# Altium project PV-Simulator.PRJPCB
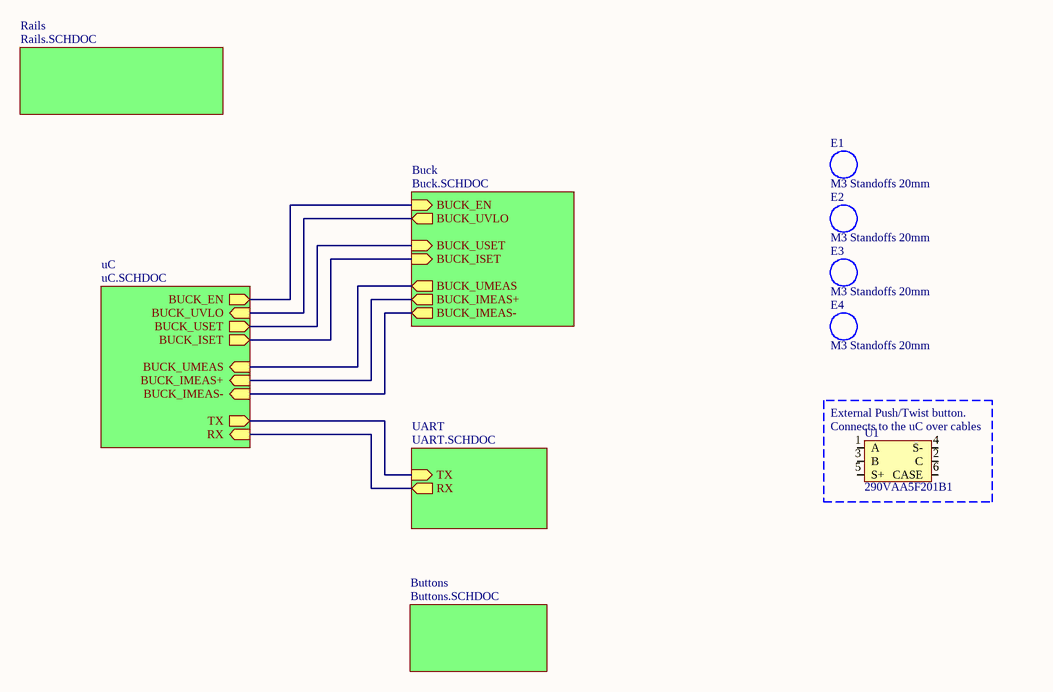
[diagram p0: PV-Simulator.SCHDOC]
5 sheets, 125 parts. Net scope: hierarchical (ports join the sheet entries above them; power ports are global).
Board file: PCB.PCBDOC
Sheets:
  PV-Simulator.SCHDOC
    UART = UART.SCHDOC
    Rails = Rails.SCHDOC
    uC = uC.SCHDOC
    Buck = Buck.SCHDOC

## Sheet PV-Simulator.SCHDOC: PV Simulator
size A4; Author: Alex Murray; DrawnBy: Alex Murray; DocumentNumber: 1; SheetNumber: 1; SheetTotal: 6; CurrentTime: 14:14; CurrentDate: 15-10-29

### Parts
E1  Type: M3 Standoffs 20mm  [THT_STANDOFF_20MM_M3]  (hidden comment: E_STANDOFF_20MM_M3_PLASTIC)
E2  Type: M3 Standoffs 20mm  [THT_STANDOFF_20MM_M3]  (hidden comment: E_STANDOFF_20MM_M3_PLASTIC)
E3  Type: M3 Standoffs 20mm  [THT_STANDOFF_20MM_M3]  (hidden comment: E_STANDOFF_20MM_M3_PLASTIC)
E4  Type: M3 Standoffs 20mm  [THT_STANDOFF_20MM_M3]  (hidden comment: E_STANDOFF_20MM_M3_PLASTIC)
U1  Type: 290VAA5F201B1  [THT_ENCODER_290VAA5F201B1]  (hidden comment: U_ENCODER_2BIT_QUAD_SPST)

### Sub-sheets
Buck = Buck.SCHDOC: BUCK_ISET (in), BUCK_EN (in), BUCK_USET (in), BUCK_UMEAS (out), BUCK_IMEAS+ (out), BUCK_IMEAS- (out), BUCK_UVLO (out)
Buttons = Buttons.SCHDOC (file not in this document): no entries
Rails = Rails.SCHDOC: no entries
UART = UART.SCHDOC: RX (out), TX (in)
uC = uC.SCHDOC: BUCK_USET (out), BUCK_ISET (out), BUCK_EN (out), BUCK_UMEAS (in), BUCK_IMEAS+ (in), BUCK_IMEAS- (in), RX (in), TX (out), BUCK_UVLO (in)

### Nets
BUCK_EN: sheet uC/BUCK_EN, sheet Buck/BUCK_EN
BUCK_IMEAS+: sheet uC/BUCK_IMEAS+, sheet Buck/BUCK_IMEAS+
BUCK_IMEAS-: sheet uC/BUCK_IMEAS-, sheet Buck/BUCK_IMEAS-
BUCK_ISET: sheet uC/BUCK_ISET, sheet Buck/BUCK_ISET
BUCK_UMEAS: sheet uC/BUCK_UMEAS, sheet Buck/BUCK_UMEAS
BUCK_USET: sheet uC/BUCK_USET, sheet Buck/BUCK_USET
BUCK_UVLO: sheet uC/BUCK_UVLO, sheet Buck/BUCK_UVLO
RX: sheet UART/RX, sheet uC/RX
TX: sheet UART/TX, sheet uC/TX

Not connected (* = marked no-connect by the designer): U1 1(A) 2(C) 3(B) 4(S-) 5(S+) 6(CASE)

### Notes on the sheet
- (near U1) External Push/Twist button.
- (near U1) Connects to the uC over cables

### Library data of the parts
E1-E4 = E_STANDOFF_20MM_M3_PLASTIC: HEX STANDOFF M3 NYLON 20MM; Supplier - Digikey: 36-25505-ND
U1 = U_ENCODER_2BIT_QUAD_SPST: 2 Bit Encoder with switch; Supplier - Digikey: CT3010-ND

## Sheet UART.SCHDOC
size A4; DocumentNumber: 2; SheetNumber: 2; SheetTotal: 6
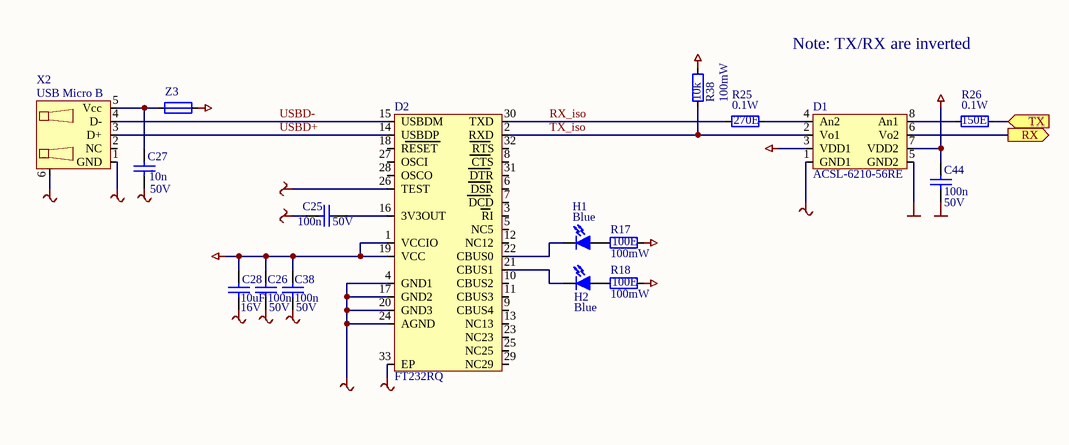
[diagram p1: UART.SCHDOC]

### Parts
C25  value 100n  Value2: 50V  [SMD_0603]  (hidden comment: C_SMD_CER_100N_50V_10%_X7R_0603)
C26  value 100n  Value2: 50V  [SMD_0603]  (hidden comment: C_SMD_CER_100N_50V_10%_X7R_0603)
C27  value 10n  Value2: 50V  [SMD_0603]  (hidden comment: C_SMD_CER_10N_50V_10%_X7R_0603)
C28  value 10uF  Value2: 16V  [SMD_0805]  (hidden comment: C_SMD_CER_10U_16V_10%_X5R_0805)
C38  value 100n  Value2: 50V  [SMD_0603]  (hidden comment: C_SMD_CER_100N_50V_10%_X7R_0603)
C44  value 100n  Value2: 50V  [SMD_0603]  (hidden comment: C_SMD_CER_100N_50V_10%_X7R_0603)
D1  Type: ACSL-6210-56RE  [SMD_SOP_8]  (hidden comment: D_ACSL-6210_SO-8)
D2  Type: FT232RQ  [SMD_QFN-32]  (hidden comment: D_FT232RQ)
H1  Type: Blue  [SMD_0603P]  (hidden comment: H_SMD_LED_BLUE_0603)
H2  Type: Blue  [SMD_0603P]  (hidden comment: H_SMD_LED_BLUE_0603)
R17  value 100E  Value2: 100mW  [SMD_0603]  (hidden comment: R_SMD_THINFILM_100E_0W1_1%_50PPM_0603)
R18  value 100E  Value2: 100mW  [SMD_0603]  (hidden comment: R_SMD_THINFILM_100E_0W1_1%_50PPM_0603)
R25  value 270E  Value2: 0.1W  [SMD_0603]  (hidden comment: R_SMD_THINFILM_270E_0W1_1%_50PPM_0603)
R26  value 150E  Value2: 0.1W  [SMD_0603]  (hidden comment: R_SMD_THINFILM_150E_0W1_1%_50PPM_0603)
R38  value 10k  Value2: 100mW  [SMD_0603]  (hidden comment: R_SMD_THINFILM_10K_0W1_1%_50PPM_0603)
X2  Type: USB Micro B  [SMD_USB_MICRO_B_2.0]  (hidden comment: X_SMD_USB_MICRO-B_2.0)
Z3  Z_SMD_FERRITE_1A5_470E@100MHZ_0603  [SMD_0603]  (value not drawn)

### Ports
RX (out), TX (in)

### Nets
+3.3V: C44.2 D1.7(VDD2)
+5Vi: C26.2 C28.2 C38.2 D1.3(VDD1) D2.1(VCCIO) D2.19(VCC) R17.2 R18.2 R38.2 Z3.2
GND: C44.1 D1.5(GND2)
GNDi: C25.1 C26.1 C27.1 C28.1 C38.1 D1.1(GND1) D2.4(GND1) D2.17(GND2) D2.20(GND3) D2.24(AGND) D2.26(TEST) D2.33(EP) X2.1(GND) X2.6(Shield)
RX: D1.6(Vo2) ; port RX
RX_iso: D2.30(TXD) R25.1
TX: R26.2 ; port TX
TX_iso: D1.2(Vo1) D2.2(RXD) R38.1
USBD+: D2.14(USBDP) X2.3(D+)
USBD-: D2.15(USBDM) X2.4(D-)
NetC25_2: C25.2 D2.16(3V3OUT)
NetC27_2: C27.2 X2.5(Vcc) Z3.1
NetD1_4: D1.4(An2) R25.2
NetD1_8: D1.8(An1) R26.1
NetD2_21: D2.21(CBUS1) H2.2
NetD2_22: D2.22(CBUS0) H1.2
NetH1_1: H1.1 R17.1
NetH2_1: H2.1 R18.1

Not connected (* = marked no-connect by the designer): D2 3(RI) 5(NC5) 6(DSR) 7(DCD) 8(CTS) 9(CBUS4) 10(CBUS2) 11(CBUS3) 12(NC12) 13(NC13) 18(RESET) 23(NC23) 25(NC25) 27(OSCI) 28(OSCO) 29(NC29) 31(DTR) 32(RTS); X2 2(NC)

### Notes on the sheet
- Note: TX/RX are inverted

### Library data of the parts
C25 C26 C38 C44 = C_SMD_CER_100N_50V_10%_X7R_0603: SMD Capacitor; Supplier - E+H-flowtec SAP: 50092748; Supplier - Digikey: 1276-1936-1-ND
C27 = C_SMD_CER_10N_50V_10%_X7R_0603: SMD Capacitor; Supplier - E+H-flowtec SAP: 50092743; Supplier - Digikey: 399-1091-1-ND
C28 = C_SMD_CER_10U_16V_10%_X5R_0805: SMD Capacitor; Supplier - E+H-flowtec SAP: 71107344; Supplier - Digikey: 490-6473-1-ND
D1 = D_ACSL-6210_SO-8: Multi-Channel and Bi-Directional 15MBd Digital Logic Gate Optocoupler; Supplier - Digikey: 516-2916-1-ND
D2 = D_FT232RQ: FT232r USB UART IC; Supplier - Digikey: 768-1008-1-ND
H1 H2 = H_SMD_LED_BLUE_0603: Blue LED, 5mA; Supplier - Digikey: VAOL-S6SB4CT-ND
R17 R18 = R_SMD_THINFILM_100E_0W1_1%_50PPM_0603: SMD Resistor; Supplier - E+H-flowtec SAP: 50092674; Supplier - Digikey: YAG2128CT-ND
R25 = R_SMD_THINFILM_270E_0W1_1%_50PPM_0603: SMD Resistor; Supplier - E+H-flowtec SAP: 50098310; Supplier - Digikey: P270DBCT-ND
R26 = R_SMD_THINFILM_150E_0W1_1%_50PPM_0603: SMD Resistor; Supplier - E+H-flowtec SAP: 50092676; Supplier - Digikey: P150DBCT-ND
R38 = R_SMD_THINFILM_10K_0W1_1%_50PPM_0603: SMD Resistor; Supplier - E+H-flowtec SAP: 50092700; Supplier - Digikey: YAG2321CT-ND
Z3 = Z_SMD_FERRITE_1A5_470E@100MHZ_0603: FERRITE CHIP 470 OHM 1500MA 0603; Value: 1.5A; Supplier - Digikey: 490-5257-1-ND; Type: BLM18KG471SN1D
X2 = X_SMD_USB_MICRO-B_2.0: Supplier - Digikey: 609-4618-1-ND

## Sheet Rails.SCHDOC
size A4; DocumentNumber: 5; SheetNumber: 5; SheetTotal: 6
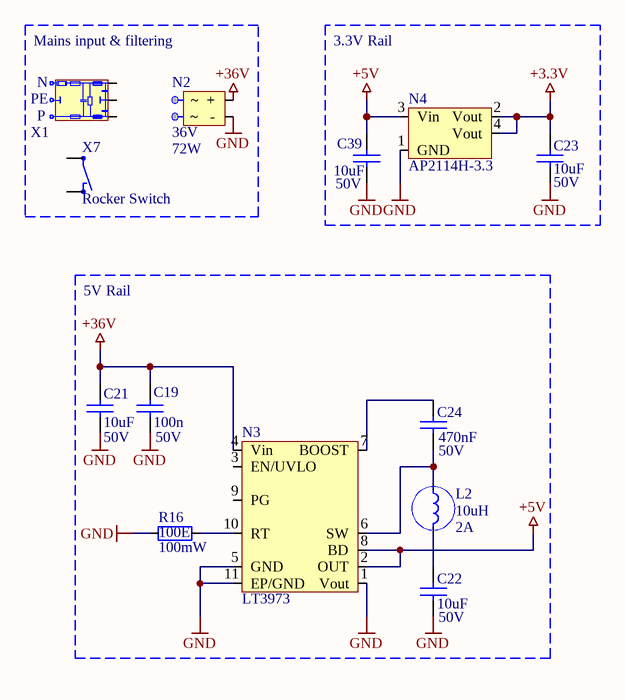
[diagram p2: Rails.SCHDOC]

### Parts
C19  value 100n  Value2: 50V  [SMD_0603]  (hidden comment: C_SMD_CER_100N_50V_10%_X7R_0603)
C21  value 10uF  Value2: 50V  [SMD_1210]  (hidden comment: C_SMD_CER_10U_50V_10%_X7R_1210)
C22  value 10uF  Value2: 50V  [SMD_1210]  (hidden comment: C_SMD_CER_10U_50V_10%_X7R_1210)
C23  value 10uF  Value2: 50V  [SMD_1210]  (hidden comment: C_SMD_CER_10U_50V_10%_X7R_1210)
C24  value 470nF  Value2: 50V  [SMD_0603]  (hidden comment: C_SMD_CER_470N_50V_10%_X7R_0603)
C39  value 10uF  Value2: 50V  [SMD_1210]  (hidden comment: C_SMD_CER_10U_50V_10%_X7R_1210)
L2  value 10uH  Value2: 2A  [SMD_INDUCT_74477710]  (hidden comment: L_SMD_10U_2A_20%_IND_74477710)
N2  value 36V  Value2: 72W  [THT_CON_P2.54_D0.9_1X2]  (hidden comment: N_EXT_ACDC_36V_75W)
N3  Type: LT3973  [SMD_DFN_10_3X3]  (hidden comment: N_LT3973-5_DFN-10)
N4  Type: AP2114H-3.3  [SMD_SOT_22_3]  (hidden comment: N_AP2114H-3.3_SOT223)
R16  value 100E  Value2: 100mW  [SMD_0603]  (hidden comment: R_SMD_THINFILM_100E_0W1_1%_50PPM_0603)
X1  X_POWER_ENTRY_MODULE_W/FILTER_W/FUSE_10A_SMD_CONNECTOR  [SMD_CON_P5.08_W2.0_L5.0_1X3]  (value not drawn)
X7  Type: Rocker Switch  [THT_CON_P5.08_D1.5_1X2]  (hidden comment: X_SWITCH_ROCKER_SPST_6A_250VAC)

### Blocks framed on the sheet
Mains input & filtering: N2 X1 X7
3.3V Rail: C23 C39 N4
5V Rail: C19 C21 C22 C24 L2 N3 R16

### Nets
+3.3V: C23.2 N4.2(Vout) N4.4(Vout)
+5V: C39.2 N3.2(OUT) N3.8(BD) N4.3(Vin)
+36V: C19.2 C21.2 N2.1(~__+) N3.4(Vin)
GND: C19.1 C21.1 C22.1 C23.1 C39.1 N2.2(~___-) N3.1(Vout) N3.5(GND) N3.11(EP/GND) N4.1(GND) R16.1
NetC22_2: C22.2 L2.2
NetC24_1: C24.1 L2.1 N3.6(SW)
NetC24_2: C24.2 N3.7(BOOST)
NetN3_10: N3.10(RT) R16.2

Not connected (* = marked no-connect by the designer): N3 3(EN/UVLO) 9(PG); X1 1 2 3; X7 1 2

### Notes on the sheet
- (in symbol X_POWER_ENTRY_MODULE_W/FILTER_W/FUSE_10A_SMD_CONNECTOR) N; PE; P

### Library data of the parts
C19 = C_SMD_CER_100N_50V_10%_X7R_0603: SMD Capacitor; Supplier - E+H-flowtec SAP: 50092748; Supplier - Digikey: 1276-1936-1-ND
C21-C23 C39 = C_SMD_CER_10U_50V_10%_X7R_1210: SMD Ceramic capacitor; Supplier - Digikey: 490-6544-1-ND
L2 = L_SMD_10U_2A_20%_IND_74477710: SMD Inductor; Supplier - Digikey: 732-1200-1-ND; Type: 74477710
N3 = N_LT3973-5_DFN-10-3x3: 42V, 750mA Step-Down Regulator with 2.5uA Quiescent Current and Integrated Diodes; Supplier - Digikey: LT3973EDD-5#PBF-ND
N4 = N_AP2114H-3.3_SOT223: 1A Low Noise CMOS LDO Regulator; Supplier - Digikey: AP2114H-3.3TRG1DICT-ND
R16 = R_SMD_THINFILM_100E_0W1_1%_50PPM_0603: SMD Resistor; Supplier - E+H-flowtec SAP: 50092674; Supplier - Digikey: YAG2128CT-ND
X1 = X_POWER_ENTRY_MODULE_W/FILTER_W/FUSE_10A_SMD_CONNECTOR: MOD POWER ENTRY INLET WITH FUSE 10A; Supplier - Digikey: 817-1489-ND
C24 = C_SMD_CER_470N_50V_10%_X7R_0603: Supplier - Digikey: 587-3170-1-ND
N2 = N_EXT_ACDC_36V_75W: Supplier - Digikey: 285-1829-ND
X7 = X_SWITCH_ROCKER_SPST_6A_250VAC: Supplier - Digikey: 360-1721-ND

## Sheet uC.SCHDOC
size A4; DocumentNumber: 4; SheetNumber: 4; SheetTotal: 6
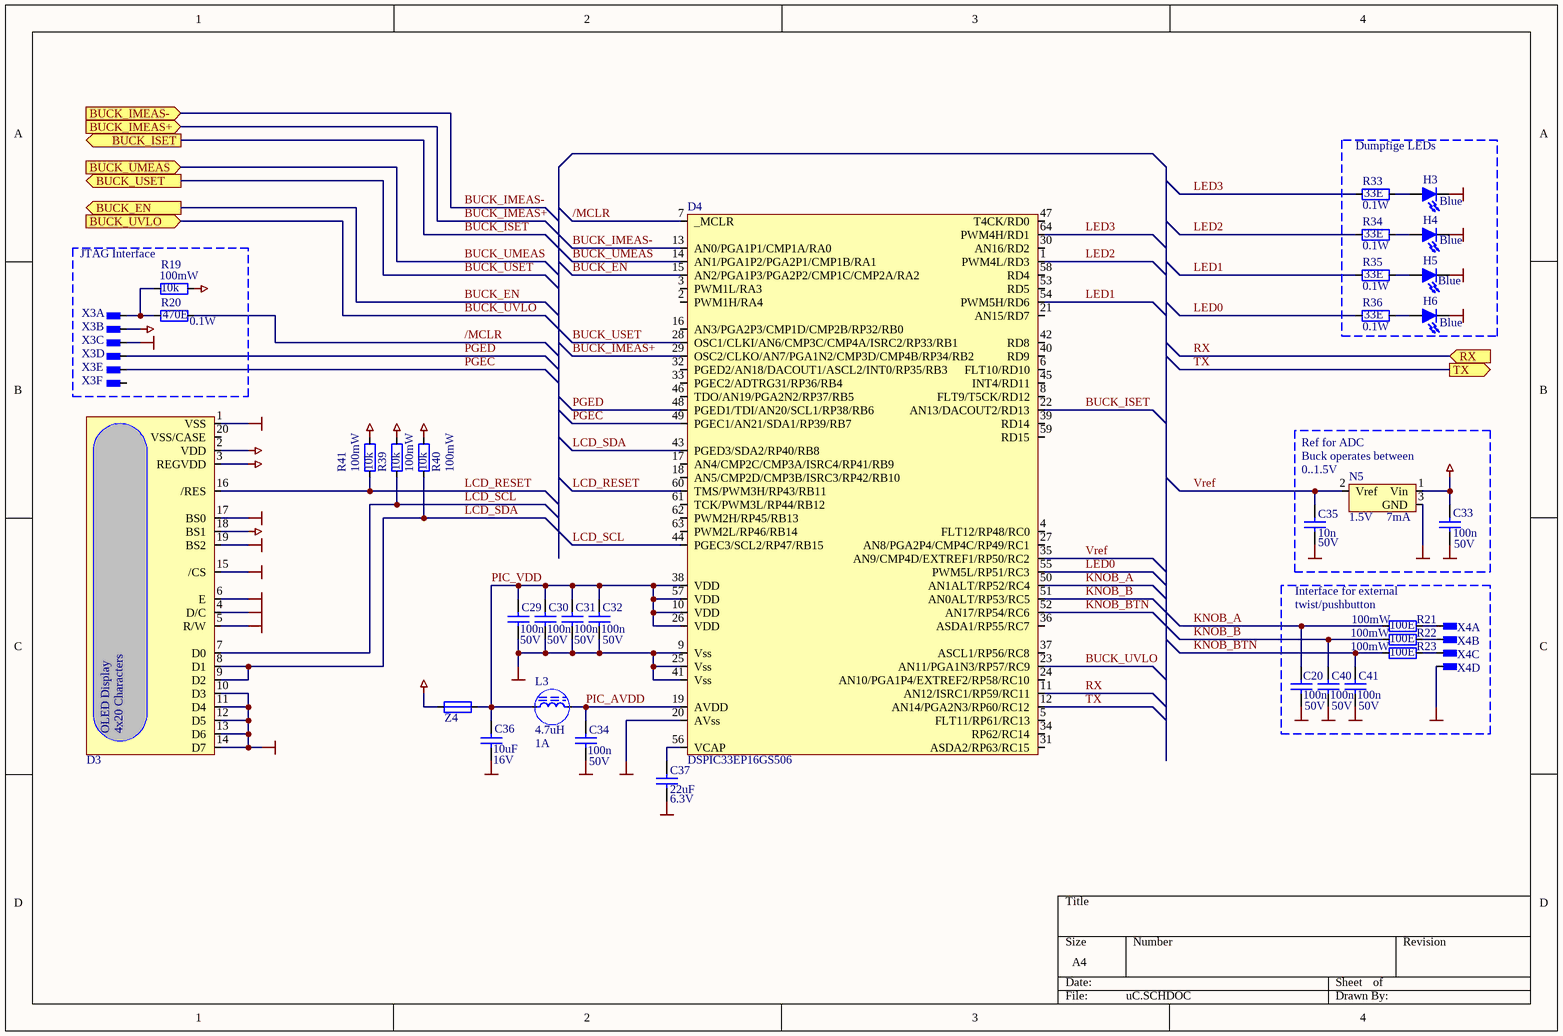
[diagram p3: uC.SCHDOC]

### Parts
C20  value 100n  Value2: 50V  [SMD_0603]  (hidden comment: C_SMD_CER_100N_50V_10%_X7R_0603)
C29  value 100n  Value2: 50V  [SMD_0603]  (hidden comment: C_SMD_CER_100N_50V_10%_X7R_0603)
C30  value 100n  Value2: 50V  [SMD_0603]  (hidden comment: C_SMD_CER_100N_50V_10%_X7R_0603)
C31  value 100n  Value2: 50V  [SMD_0603]  (hidden comment: C_SMD_CER_100N_50V_10%_X7R_0603)
C32  value 100n  Value2: 50V  [SMD_0603]  (hidden comment: C_SMD_CER_100N_50V_10%_X7R_0603)
C33  value 100n  Value2: 50V  [SMD_0603]  (hidden comment: C_SMD_CER_100N_50V_10%_X7R_0603)
C34  value 100n  Value2: 50V  [SMD_0603]  (hidden comment: C_SMD_CER_100N_50V_10%_X7R_0603)
C35  value 10n  Value2: 50V  [SMD_0603]  (hidden comment: C_SMD_CER_10N_50V_10%_X7R_0603)
C36  value 10uF  Value2: 16V  [SMD_0805]  (hidden comment: C_SMD_CER_10U_16V_10%_X5R_0805)
C37  value 22uF  Value2: 6.3V  [SMD_1206]  (hidden comment: C_SMD_CER_22U_6V3_20%_X5R_1206)
C40  value 100n  Value2: 50V  [SMD_0603]  (hidden comment: C_SMD_CER_100N_50V_10%_X7R_0603)
C41  value 100n  Value2: 50V  [SMD_0603]  (hidden comment: C_SMD_CER_100N_50V_10%_X7R_0603)
D3  D_LCD_80CHAR_20X4_NHD-0420CW-AR3  [THT_CON_P2.54_D0.9_2X10]  (value not drawn)
D4  Type: DSPIC33EP16GS506  [SMD_TQFP-64]  (hidden comment: D_DSPIC33EP16GS506_TQFP-64)
H3  Type: Blue  [SMD_0603P]  (hidden comment: H_SMD_LED_BLUE_0603)
H4  Type: Blue  [SMD_0603P]  (hidden comment: H_SMD_LED_BLUE_0603)
H5  Type: Blue  [SMD_0603P]  (hidden comment: H_SMD_LED_BLUE_0603)
H6  Type: Blue  [SMD_0603P]  (hidden comment: H_SMD_LED_BLUE_0603)
L3  value 4.7uH  Value2: 1A  [SMD_0806]  (hidden comment: L_SMD_4U7_1A_20%_0806)
N5  value 1.5V  Value2: 7mA  [SMD_SOT_23_3]  (hidden comment: N_UREF_1V5_0A007_52UVRMS_ISL21080CIH315Z_SOT-23-3)
R19  value 10k  Value2: 100mW  [SMD_0603]  (hidden comment: R_SMD_THINFILM_10K_0W1_1%_50PPM_0603)
R20  value 470E  Value2: 0.1W  [SMD_0603]  (hidden comment: R_SMD_THINFILM_470E_0W1_1%_50PPM_0603)
R21  value 100E  Value2: 100mW  [SMD_0603]  (hidden comment: R_SMD_THINFILM_100E_0W1_1%_50PPM_0603)
R22  value 100E  Value2: 100mW  [SMD_0603]  (hidden comment: R_SMD_THINFILM_100E_0W1_1%_50PPM_0603)
R23  value 100E  Value2: 100mW  [SMD_0603]  (hidden comment: R_SMD_THINFILM_100E_0W1_1%_50PPM_0603)
R33  value 33E  Value2: 0.1W  [SMD_0603]  (hidden comment: R_SMD_THINFILM_33E_0W1_1%_50PPM_0603)
R34  value 33E  Value2: 0.1W  [SMD_0603]  (hidden comment: R_SMD_THINFILM_33E_0W1_1%_50PPM_0603)
R35  value 33E  Value2: 0.1W  [SMD_0603]  (hidden comment: R_SMD_THINFILM_33E_0W1_1%_50PPM_0603)
R36  value 33E  Value2: 0.1W  [SMD_0603]  (hidden comment: R_SMD_THINFILM_33E_0W1_1%_50PPM_0603)
R39  value 10k  Value2: 100mW  [SMD_0603]  (hidden comment: R_SMD_THINFILM_10K_0W1_1%_50PPM_0603)
R40  value 10k  Value2: 100mW  [SMD_0603]  (hidden comment: R_SMD_THINFILM_10K_0W1_1%_50PPM_0603)
R41  value 10k  Value2: 100mW  [SMD_0603]  (hidden comment: R_SMD_THINFILM_10K_0W1_1%_50PPM_0603)
X3  X_CONNECTOR_P2.54_D0.9_1X6  [THT_CON_P2.54_D0.9_1X6]  (value not drawn)  (parts A,B,C,D,E,F of 6)
X4  X_CONNECTOR_P2.54_D0.9_1X4  [THT_CON_P2.54_D0.9_1X4]  (value not drawn)  (parts A,B,C,D of 4)
Z4  Z_SMD_FERRITE_1A5_470E@100MHZ_0603  [SMD_0603]  (value not drawn)

### Blocks framed on the sheet
Dumpfige LEDs: H3-H6 R33-R36
JTAG Interface: R19 R20 X3

### Ports
BUCK_EN (out), BUCK_IMEAS+ (in), BUCK_IMEAS- (in), BUCK_ISET (out), BUCK_UMEAS (in), BUCK_USET (out), BUCK_UVLO (in), RX (in), TX (out)

### Nets
+3.3V: C33.2 N5.1(Vin) R19.2 X3.2 Z4.2
+5V: D3.2(VDD) D3.3(REGVDD) D3.18(BS1) R39.2 R40.2 R41.2
GND: C20.1 C29.1 C30.1 C31.1 C32.1 C33.1 C34.1 C35.1 C36.1 C37.1 C40.1 C41.1 D3.1(VSS) D3.4(D/C) D3.5(R/W) D3.6(E) D3.10(D3) D3.11(D4) D3.12(D5) D3.13(D6) D3.14(D7) D3.15(/CS) D3.17(BS0) D3.19(BS2) D4.9(Vss) D4.20(AVss) D4.25(Vss) D4.41(Vss) H3.2 H4.2 H5.2 H6.2 N5.3(GND) X3.3 X4.4
/MCLR: D4.7(_MCLR) R20.2
BUCK_EN: D4.15(AN2/PGA1P3/PGA2P2/CMP1C/CMP2A/RA2) ; port BUCK_EN
BUCK_IMEAS+: D4.29(OSC2/CLKO/AN7/PGA1N2/CMP3D/CMP4B/RP34/RB2) ; port BUCK_IMEAS+
BUCK_IMEAS-: D4.13(AN0/PGA1P1/CMP1A/RA0) ; port BUCK_IMEAS-
BUCK_ISET: D4.22(AN13/DACOUT2/RD13) ; port BUCK_ISET
BUCK_UMEAS: D4.14(AN1/PGA1P2/PGA2P1/CMP1B/RA1) ; port BUCK_UMEAS
BUCK_USET: D4.28(OSC1/CLKI/AN6/CMP3C/CMP4A/ISRC2/RP33/RB1) ; port BUCK_USET
BUCK_UVLO: D4.23(AN11/PGA1N3/RP57/RC9) ; port BUCK_UVLO
KNOB_A: C20.2 D4.50(AN1ALT/RP52/RC4) R21.1
KNOB_B: C40.2 D4.51(AN0ALT/RP53/RC5) R22.1
KNOB_BTN: C41.2 D4.52(AN17/RP54/RC6) R23.1
LCD_RESET: D3.16(/RES) D4.60(TMS/PWM3H/RP43/RB11) R41.1
LCD_SCL: D3.7(D0) D4.44(PGEC3/SCL2/RP47/RB15) R39.1
LCD_SDA: D3.8(D1) D3.9(D2) D4.43(PGED3/SDA2/RP40/RB8) R40.1
LED0: D4.55(PWM5L/RP51/RC3) R36.1
LED1: D4.54(PWM5H/RD6) R35.1
LED2: D4.1(PWM4L/RD3) R34.1
LED3: D4.64(PWM4H/RD1) R33.1
PGEC: D4.49(PGEC1/AN21/SDA1/RP39/RB7) X3.5
PGED: D4.48(PGED1/TDI/AN20/SCL1/RP38/RB6) X3.4
PIC_AVDD: C34.2 D4.19(AVDD) L3.2
PIC_VDD: C29.2 C30.2 C31.2 C32.2 C36.2 D4.10(VDD) D4.26(VDD) D4.38(VDD) D4.57(VDD) L3.1 Z4.1
RX: D4.11(AN12/ISRC1/RP59/RC11) ; port RX
TX: D4.12(AN14/PGA2N3/RP60/RC12) ; port TX
Vref: C35.2 D4.35(AN9/CMP4D/EXTREF1/RP50/RC2) N5.2(Vref)
NetC37_2: C37.2 D4.56(VCAP)
NetH3_1: H3.1 R33.2
NetH4_1: H4.1 R34.2
NetH5_1: H5.1 R35.2
NetH6_1: H6.1 R36.2
NetR19_1: R19.1 R20.1 X3.1
NetR21_2: R21.2 X4.1
NetR22_2: R22.2 X4.2
NetR23_2: R23.2 X4.3

Not connected (* = marked no-connect by the designer): D3 20(VSS/CASE); D4 2(PWM1H/RA4) 3(PWM1L/RA3) 4(FLT12/RP48/RC0) 5(FLT11/RP61/RC13) 6(FLT10/RD10) 8(FLT9/T5CK/RD12) 16(AN3/PGA2P3/CMP1D/CMP2B/RP32/RB0) 17(AN4/CMP2C/CMP3A/ISRC4/RP41/RB9) 18(AN5/CMP2D/CMP3B/ISRC3/RP42/RB10) 21(AN15/RD7) 24(AN10/PGA1P4/EXTREF2/RP58/RC10) 27(AN8/PGA2P4/CMP4C/RP49/RC1) 30(AN16/RD2) 31(ASDA2/RP63/RC15) 32(PGED2/AN18/DACOUT1/ASCL2/INT0/RP35/RB3) 33(PGEC2/ADTRG31/RP36/RB4) 34(RP62/RC14) 36(ASDA1/RP55/RC7) 37(ASCL1/RP56/RC8) 39(RD14) 40(RD9) 42(RD8) 45(INT4/RD11) 46(TDO/AN19/PGA2N2/RP37/RB5) 47(T4CK/RD0) 53(RD5) 58(RD4) 59(RD15) 61(TCK/PWM3L/RP44/RB12) 62(PWM2H/RP45/RB13) 63(PWM2L/RP46/RB14); X3 6

### Notes on the sheet
- (near N5) Ref for ADC
- (near N5) Buck operates between
- (near N5) 0..1.5V
- Interface for external
- (near R21) twist/pushbutton
- (in symbol D_LCD_80CHAR_20X4_NHD-0420CW-AR3) OLED Display; 4x20 Characters

### Library data of the parts
C20 C29-C34 C40 C41 = C_SMD_CER_100N_50V_10%_X7R_0603: SMD Capacitor; Supplier - E+H-flowtec SAP: 50092748; Supplier - Digikey: 1276-1936-1-ND
C35 = C_SMD_CER_10N_50V_10%_X7R_0603: SMD Capacitor; Supplier - E+H-flowtec SAP: 50092743; Supplier - Digikey: 399-1091-1-ND
C36 = C_SMD_CER_10U_16V_10%_X5R_0805: SMD Capacitor; Supplier - E+H-flowtec SAP: 71107344; Supplier - Digikey: 490-6473-1-ND
C37 = C_SMD_CER_22U_6V3_20%_X5R_1206: SMD Capacitor; Supplier - E+H-flowtec SAP: 71128390; Supplier - Digikey: 587-3398-1-ND
H3-H6 = H_SMD_LED_BLUE_0603: Blue LED, 5mA; Supplier - Digikey: VAOL-S6SB4CT-ND
L3 = L_SMD_4U7_1A_20%_0806: SMD Inductor; Supplier - Digikey: 732-2956-1-ND
R19 R39-R41 = R_SMD_THINFILM_10K_0W1_1%_50PPM_0603: SMD Resistor; Supplier - E+H-flowtec SAP: 50092700; Supplier - Digikey: YAG2321CT-ND
R20 = R_SMD_THINFILM_470E_0W1_1%_50PPM_0603: SMD Resistor; Supplier - E+H-flowtec SAP: 50092681
R21-R23 = R_SMD_THINFILM_100E_0W1_1%_50PPM_0603: SMD Resistor; Supplier - E+H-flowtec SAP: 50092674; Supplier - Digikey: YAG2128CT-ND
R33-R36 = R_SMD_THINFILM_33E_0W1_1%_50PPM_0603: SMD Resistor; Supplier - E+H-flowtec SAP: 50092668; Supplier - Digikey: MCT0603-33.0-CFCT-ND
X3 = X_CONNECTOR_P2.54_D0.9_1X6: Pitch 2.54, Diameter 0.9mm, 1 row, 6 columns; Type: Pitch 2.54, Diameter 0.9mm, 1 row, 3 columns
X4 = X_CONNECTOR_P2.54_D0.9_1X4: Pitch 2.54, Diameter 0.9mm, 1 row, 4 columns; Type: Pitch 2.54, Diameter 0.9mm, 1 row, 3 columns
Z4 = Z_SMD_FERRITE_1A5_470E@100MHZ_0603: as Z3 on sheet UART; Supplier - Digikey: 490-5257-1-ND; Type: BLM18KG471SN1D
D3 = D_LCD_80CHAR_20X4_NHD-0420CW-AR3: Supplier - Digikey: NHD-0420CW-AR3-ND
D4 = D_DSPIC33EP16GS506_TQFP-64: Supplier - Digikey: DSPIC33EP16GS506-I/PT-ND
N5 = N_UREF_1V5_0A007_52UVRMS_ISL21080CIH315Z_SOT-23-3: Supplier - Digikey: ISL21080CIH315Z-TKCT-ND; Type: ISL21080CIH315Z-TK

## Sheet Buck.SCHDOC
size A4; DocumentNumber: 3; SheetNumber: 3; SheetTotal: 6
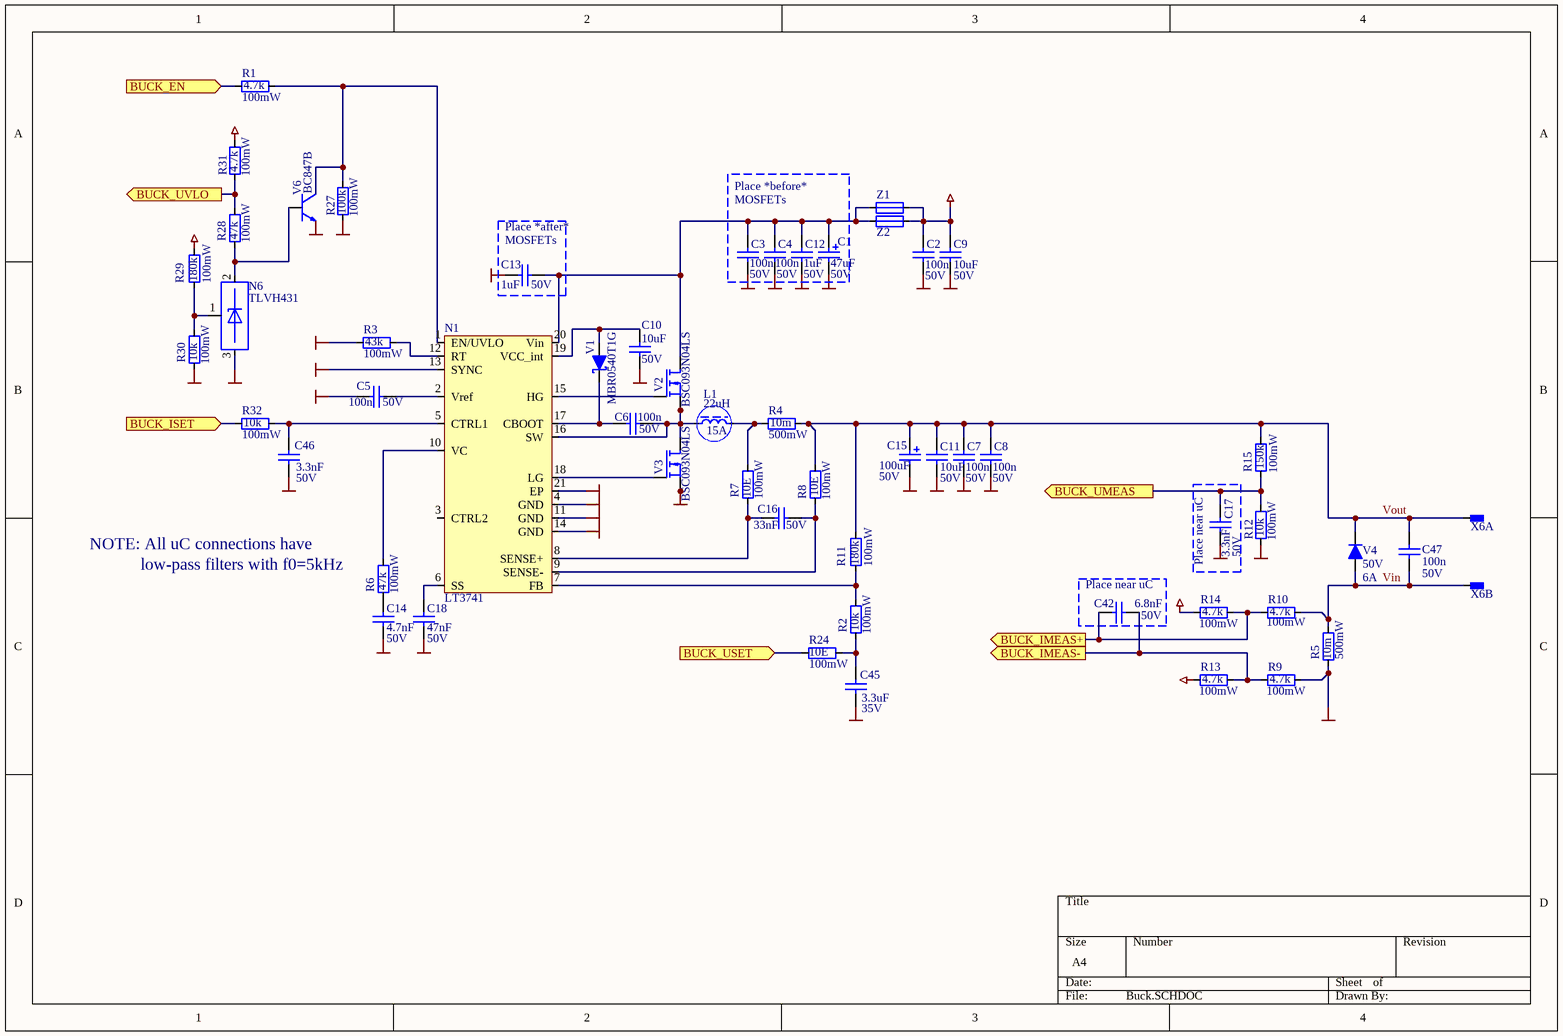
[diagram p4: Buck.SCHDOC]

### Parts
C1  value 47uF  Value2: 50V  [SMD_CAP_CV_8x10L]  (hidden comment: C_SMD_ALU_47U_50V_20%_PCV1H470MCL7GS)
C2  value 100n  Value2: 50V  [SMD_0603]  (hidden comment: C_SMD_CER_100N_50V_10%_X7R_0603)
C3  value 100n  Value2: 50V  [SMD_0603]  (hidden comment: C_SMD_CER_100N_50V_10%_X7R_0603)
C4  value 100n  Value2: 50V  [SMD_0603]  (hidden comment: C_SMD_CER_100N_50V_10%_X7R_0603)
C5  value 100n  Value2: 50V  [SMD_0603]  (hidden comment: C_SMD_CER_100N_50V_10%_X7R_0603)
C6  value 100n  Value2: 50V  [SMD_0603]  (hidden comment: C_SMD_CER_100N_50V_10%_X7R_0603)
C7  value 100n  Value2: 50V  [SMD_0603]  (hidden comment: C_SMD_CER_100N_50V_10%_X7R_0603)
C8  value 100n  Value2: 50V  [SMD_0603]  (hidden comment: C_SMD_CER_100N_50V_10%_X7R_0603)
C9  value 10uF  Value2: 50V  [SMD_1210]  (hidden comment: C_SMD_CER_10U_50V_10%_X7R_1210)
C10  value 10uF  Value2: 50V  [SMD_1210]  (hidden comment: C_SMD_CER_10U_50V_10%_X7R_1210)
C11  value 10uF  Value2: 50V  [SMD_1210]  (hidden comment: C_SMD_CER_10U_50V_10%_X7R_1210)
C12  value 1uF  Value2: 50V  [SMD_0805]  (hidden comment: C_SMD_CER_1U_50V_10%_X7R_0805)
C13  value 1uF  Value2: 50V  [SMD_0805]  (hidden comment: C_SMD_CER_1U_50V_10%_X7R_0805)
C14  value 4.7nF  Value2: 50V  [SMD_0603]  (hidden comment: C_SMD_CER_4N7_50V_10%_X7R_0603)
C15  value 100uF  Value2: 50V  [SMD_CAP_CV_10x12.7L]  (hidden comment: C_SMD_ALU_100U_50V_20%_PCV1H101MCL2GS)
C16  value 33nF  Value2: 50V  [SMD_0603]  (hidden comment: C_SMD_CER_33N_50V_10%_X7R_0603)
C17  value 3.3nF  Value2: 50V  [SMD_0603]  (hidden comment: C_SMD_CER_3N3_50V_10%_X7R_0603)
C18  value 47nF  Value2: 50V  [SMD_0603]  (hidden comment: C_SMD_CER_47N_50V_10%_X7R_0603)
C42  value 6.8nF  Value2: 50V  [SMD_0603]  (hidden comment: C_SMD_CER_6N8_50V_10%_X7R_0603)
C45  value 3.3uF  Value2: 35V  [SMD_0805]  (hidden comment: C_SMD_CER_3U3_35V_10%_X7R_0805)
C46  value 3.3nF  Value2: 50V  [SMD_0603]  (hidden comment: C_SMD_CER_3N3_50V_10%_X7R_0603)
C47  value 100n  Value2: 50V  [SMD_0603]  (hidden comment: C_SMD_CER_100N_50V_10%_X7R_0603)
L1  value 22uH  Value2: 15A  [SMD_INDUCT-74435582200]  (hidden comment: L_SMD_22U_15A_7MOHM_20%_74435582200)
N1  Type: LT3741  [SMD_QFN-20]  (hidden comment: N_LT3741EUF_QFN-20)
N6  Type: TLVH431  [SMD_SOT_23_3]  (hidden comment: N_TLVH431_SOT23-3)
R1  value 4.7k  Value2: 100mW  [SMD_0603]  (hidden comment: R_SMD_THINFILM_4K7_0W1_1%_50PPM_0603)
R2  value 10k  Value2: 100mW  [SMD_0603]  (hidden comment: R_SMD_THINFILM_10K_0W1_1%_50PPM_0603)
R3  value 43k  Value2: 100mW  [SMD_0603]  (hidden comment: R_SMD_THINFILM_43K_0W1_0.1%_25PPM_0603)
R4  value 10m  Value2: 500mW  [SMD_1206]  (hidden comment: R_SMD_THICKFILM_0E01_0W5_0.5%_50PPM_1206)
R5  value 10m  Value2: 500mW  [SMD_1206]  (hidden comment: R_SMD_THICKFILM_0E01_0W5_0.5%_50PPM_1206)
R6  value 47k  Value2: 100mW  [SMD_0603]  (hidden comment: R_SMD_THINFILM_47K_0W1_1%_50PPM_0603)
R7  value 10E  Value2: 100mW  [SMD_0603]  (hidden comment: R_SMD_THINFILM_10E_0W1_1%_50PPM_0603)
R8  value 10E  Value2: 100mW  [SMD_0603]  (hidden comment: R_SMD_THINFILM_10E_0W1_1%_50PPM_0603)
R9  value 4.7k  Value2: 100mW  [SMD_0603]  (hidden comment: R_SMD_THINFILM_4K7_0W1_1%_50PPM_0603)
R10  value 4.7k  Value2: 100mW  [SMD_0603]  (hidden comment: R_SMD_THINFILM_4K7_0W1_1%_50PPM_0603)
R11  value 180k  Value2: 100mW  [SMD_0603]  (hidden comment: R_SMD_THINFILM_180K_0W1_0.1%_25PPM_0603)
R12  value 10k  Value2: 100mW  [SMD_0603]  (hidden comment: R_SMD_THINFILM_10K_0W1_1%_50PPM_0603)
R13  value 4.7k  Value2: 100mW  [SMD_0603]  (hidden comment: R_SMD_THINFILM_4K7_0W1_1%_50PPM_0603)
R14  value 4.7k  Value2: 100mW  [SMD_0603]  (hidden comment: R_SMD_THINFILM_4K7_0W1_1%_50PPM_0603)
R15  value 150k  Value2: 100mW  [SMD_0603]  (hidden comment: R_SMD_THINFILM_150K_0W1_1%_50PPM_0603)
R24  value 10E  Value2: 100mW  [SMD_0603]  (hidden comment: R_SMD_THINFILM_10E_0W1_1%_50PPM_0603)
R27  value 100k  Value2: 100mW  [SMD_0603]  (hidden comment: R_SMD_THINFILM_100K_0W1_1%_50PPM_0603)
R28  value 47k  Value2: 100mW  [SMD_0603]  (hidden comment: R_SMD_THINFILM_47K_0W1_1%_50PPM_0603)
R29  value 180k  Value2: 100mW  [SMD_0603]  (hidden comment: R_SMD_THINFILM_180K_0W1_0.1%_25PPM_0603)
R30  value 10k  Value2: 100mW  [SMD_0603]  (hidden comment: R_SMD_THINFILM_10K_0W1_1%_50PPM_0603)
R31  value 4.7k  Value2: 100mW  [SMD_0603]  (hidden comment: R_SMD_THINFILM_4K7_0W1_1%_50PPM_0603)
R32  value 10k  Value2: 100mW  [SMD_0603]  (hidden comment: R_SMD_THINFILM_10K_0W1_1%_50PPM_0603)
V1  Type: MBR0540T1G  [SMD_SOD_123]  (hidden comment: V_SMD_SCHOTTKY_MBR0540T1G_40V_0A5_SOD-123)
V2  Type: BSC093N04LS  [SMD_PG-TDSON-8]  (hidden comment: V_SMD_FET_NMOS_BSC093N04LS_40V_13A_24NC_0E0093_PG-TDSON-8)
V3  Type: BSC093N04LS  [SMD_PG-TDSON-8]  (hidden comment: V_SMD_FET_NMOS_BSC093N04LS_40V_13A_24NC_0E0093_PG-TDSON-8)
V4  value 50V  Value2: 6A  [THT_6A05-T_2]  (hidden comment: V_THT_DIODE_6A05-T_50V_6A)
V6  Type: BC847B  [SMD_SOT_23_3]  (hidden comment: V_SMD_TRANS_NPN_BC847B_50V_0A2_SOT-23-3)
X6  X_CONNECTOR_P2.54_D0.9_1X2  [THT_CON_P2.54_D0.9_1X2]  (value not drawn)  (parts A,B of 2)
Z1  Z_SMD_FERRITE_5A_60E@100MHZ_0805  [SMD_0805]  (value not drawn)
Z2  Z_SMD_FERRITE_5A_60E@100MHZ_0805  [SMD_0805]  (value not drawn)

### Blocks framed on the sheet
Place near uC: C17
Place near uC: C42

### Ports
BUCK_EN (in), BUCK_IMEAS+ (out), BUCK_IMEAS- (out), BUCK_ISET (in), BUCK_UMEAS (out), BUCK_USET (in), BUCK_UVLO (out)

### Nets
+3.3V: R13.2 R14.2 R31.2
+36V: C2.2 C9.2 R29.2 Z1.2 Z2.2
GND: C1.1 C2.1 C3.1 C4.1 C5.2 C7.1 C8.1 C9.1 C10.2 C11.1 C12.1 C13.2 C14.1 C15.1 C17.1 C18.1 C45.1 C46.1 N1.4(GND) N1.11(GND) N1.13(SYNC) N1.14(GND) N1.21(EP) N6.3 R3.1 R5.1 R9.1 R12.1 R27.1 R30.1 V3.1(Source1) V3.2(Source2) V3.3(Source3) V6.2(E)
BUCK_EN: R1.1 ; port BUCK_EN
BUCK_IMEAS+: C42.1 R10.2 R14.1 ; port BUCK_IMEAS+
BUCK_IMEAS-: C42.2 R9.2 R13.1 ; port BUCK_IMEAS-
BUCK_ISET: R32.1 ; port BUCK_ISET
BUCK_UMEAS: C17.2 R12.2 R15.1 ; port BUCK_UMEAS
BUCK_USET: R24.1 ; port BUCK_USET
BUCK_UVLO: R28.2 R31.1 ; port BUCK_UVLO
Vin: C47.1 R5.2 R10.1 V4.1 X6.2
Vout: C7.2 C8.2 C11.2 C15.2 C47.2 R4.2 R8.2 R11.2 R15.2 V4.2 X6.1
NetC1_2: C1.2 C3.2 C4.2 C12.2 C13.1 N1.20(Vin) V2.5(Drain) Z1.1 Z2.1
NetC5_1: C5.1 N1.2(Vref)
NetC6_1: C6.1 N1.17(CBOOT) V1.2
NetC6_2: C6.2 L1.1 N1.16(SW) V2.1(Source1) V2.2(Source2) V2.3(Source3) V3.5(Drain)
NetC10_1: C10.1 N1.19(VCC_int) V1.1
NetC14_2: C14.2 R6.1
NetC16_1: C16.1 N1.9(SENSE-) R8.1
NetC16_2: C16.2 N1.8(SENSE+) R7.1
NetC18_2: C18.2 N1.6(SS)
NetC45_2: C45.2 R2.2 R24.2
NetC46_2: C46.2 N1.5(CTRL1) R32.2
NetL1_2: L1.2 R4.1 R7.2
NetN1_1: N1.1(EN/UVLO) R1.2 R27.2 V6.3(C)
NetN1_7: N1.7(FB) R2.1 R11.1
NetN1_10: N1.10(VC) R6.2
NetN1_12: N1.12(RT) R3.2
NetN1_15: N1.15(HG) V2.4(Gate)
NetN1_18: N1.18(LG) V3.4(Gate)
NetN6_1: N6.1 R29.1 R30.2
NetN6_2: N6.2 R28.1 V6.1(B)

Not connected (* = marked no-connect by the designer): N1 3(CTRL2)

### Notes on the sheet
- (near C13) Place *after*
- (near C13) MOSFETs
- Place *before*
- MOSFETs
- NOTE: All uC connections have
- (near R6) low-pass filters with f0=5kHz

### Library data of the parts
C2-C8 C47 = C_SMD_CER_100N_50V_10%_X7R_0603: SMD Capacitor; Supplier - E+H-flowtec SAP: 50092748; Supplier - Digikey: 1276-1936-1-ND
C9-C11 = C_SMD_CER_10U_50V_10%_X7R_1210: SMD Ceramic capacitor; Supplier - Digikey: 490-6544-1-ND
C14 = C_SMD_CER_4N7_50V_10%_X7R_0603: SMD Capacitor ceramic; Supplier - E+H-flowtec SAP: 50092742; Supplier - Digikey: 478-1223-1-ND
C17 C46 = C_SMD_CER_3N3_50V_10%_X7R_0603: Thinfilm Ceramic Capacitor; Supplier - Digikey: 490-1503-1-ND
C18 = C_SMD_CER_47N_50V_10%_X7R_0603: SMD capacitor; Supplier - E+H-flowtec SAP: 50092746; Supllier - Digikey: 1276-1063-1-ND
L1 = L_SMD_22U_15A_7MOHM_20%_74435582200: Core Material: Manganese Zinc; Supplier - Digikey: 732-4237-1-ND
N1 = N_LT3741EUF_QFN-20: High Power, CCVC, Step-Down Controller; Supplier - Digikey: LT3741EUF#PBF-ND
N6 = N_TLVH431_SOT23-3: LOW-VOLTAGE ADJUSTABLE PRECISION SHUNT REGULATORS; Supplier - E+H-flowtec SAP: 71120701; Supplier - Digikey: 296-17972-1-ND
R1 R9 R10 R13 R14 R31 = R_SMD_THINFILM_4K7_0W1_1%_50PPM_0603: SMD Resistor; Supplier - E+H-flowtec SAP: 50092694; Supplier - Digikey: YAG1238CT-ND
R2 R12 R30 R32 = R_SMD_THINFILM_10K_0W1_1%_50PPM_0603: SMD Resistor; Supplier - E+H-flowtec SAP: 50092700; Supplier - Digikey: YAG2321CT-ND
R3 = R_SMD_THINFILM_43K_0W1_0.1%_25PPM_0603: SMD Resistor; Supplier - Digikey: P43KDBCT-ND
R4 R5 = R_SMD_THICKFILM_0E01_0W5_0.5%_50PPM_1206: SMD Current sense resistor; Supplier - Digikey: LVK12R010DERCT-ND
R6 R28 = R_SMD_THINFILM_47K_0W1_1%_50PPM_0603: SMD Resistor; Supplier - E+H-flowtec SAP: 50092708; Supplier - Digikey: YAG3355CT-ND
R7 R8 R24 = R_SMD_THINFILM_10E_0W1_1%_50PPM_0603: SMD Resistor; Supplier - E+H-flowtec SAP: 50092664; Supplier - Digikey: YAG3351CT-ND
R11 R29 = R_SMD_THINFILM_180K_0W1_0.1%_25PPM_0603: SMD Resistor; Supplier - Digikey: P180KDBCT-ND
R15 = R_SMD_THINFILM_150K_0W1_1%_50PPM_0603: SMD Resistor; Supplier - E+H-flowtec SAP: 50092716; Supplier - Digikey: P150KDBCT-ND
R27 = R_SMD_THINFILM_100K_0W1_1%_50PPM_0603: SMD Resistor; Supplier - E+H-flowtec SAP: 50092714; Supplier - Digikey: YAG2319CT-ND
V1 = V_SMD_SCHOTTKY_MBR0540T1G_40V_0A5_SOD-123: Schottky diode, 40V, 500mA, SOD-123; Supplier - Digikey: MBR0540T1GOSCT-ND
V2 V3 = V_SMD_FET_NMOS_BSC093N04LS_40V_13A_24NC_0E0093_PG-TDSON-8: Fast switching mosfet for SMPS; Supplier - Digikey: BSC093N04LS GCT-ND
V4 = V_THT_DIODE_6A05-T_50V_6A: 6A05-T; Supplier - Digikey: 6A05DICT-ND
V6 = V_SMD_TRANS_NPN_BC847B_50V_0A2_SOT-23-3: NPN Transistor; Supplier - E+H-flowtec SAP: 50019820; Supplier - Digikey: BC847BLT1GOSCT-ND
X6 = X_CONNECTOR_P2.54_D0.9_1X2: Pitch 2.54, Diameter 0.9mm, 1 row, 2 columns; Type: Pitch 2.54, Diameter 0.9mm, 1 row, 2 columns
Z1 Z2 = Z_SMD_FERRITE_5A_60E@100MHZ_0805: BEAD FERRITE 60 OHM 5A; Supplier - Digikey: MH2029-600YCT-ND; Type: MH2029-600Y; Value: 5A
C1 = C_SMD_ALU_47U_50V_20%_PCV1H470MCL7GS: Supplier - Digikey: 493-4554-1-ND
C12 C13 = C_SMD_CER_1U_50V_10%_X7R_0805: Supplier - Digikey: 587-2910-1-ND
C15 = C_SMD_ALU_100U_50V_20%_PCV1H101MCL2GS: Supplier - Digikey: 493-4558-1-ND
C16 = C_SMD_CER_33N_50V_10%_X7R_0603: Supplier - Digikey: 1276-2042-1-ND
C42 = C_SMD_CER_6N8_50V_10%_X7R_0603: Supplier - Digikey: 1276-1185-1-ND
C45 = C_SMD_CER_3U3_35V_10%_X7R_0805: Supplier - Digikey: 445-7553-1-ND

## Nets that join several sheets
+3.3V: UART (C44.2 D1.7), Rails (C23.2 N4.2 N4.4), uC (5 pins), Buck (R13.2 R14.2 R31.2)
+5V: Rails (C39.2 N3.2 N3.8 N4.3), uC (6 pins)
+36V: Rails (C19.2 C21.2 N2.1 N3.4), Buck (5 pins)
GND: UART (C44.1 D1.5), Rails (11 pins), uC (35 pins), Buck (34 pins)
BUCK_EN: uC (D4.15), Buck (R1.1)
BUCK_IMEAS+: uC (D4.29), Buck (C42.1 R10.2 R14.1)
BUCK_IMEAS-: uC (D4.13), Buck (C42.2 R9.2 R13.1)
BUCK_ISET: uC (D4.22), Buck (R32.1)
BUCK_UMEAS: uC (D4.14), Buck (C17.2 R12.2 R15.1)
BUCK_USET: uC (D4.28), Buck (R24.1)
BUCK_UVLO: uC (D4.23), Buck (R28.2 R31.1)
RX: UART (D1.6), uC (D4.11)
TX: UART (R26.2), uC (D4.12)